# Altium schematic sheet Transmisor.SchDoc
size A3
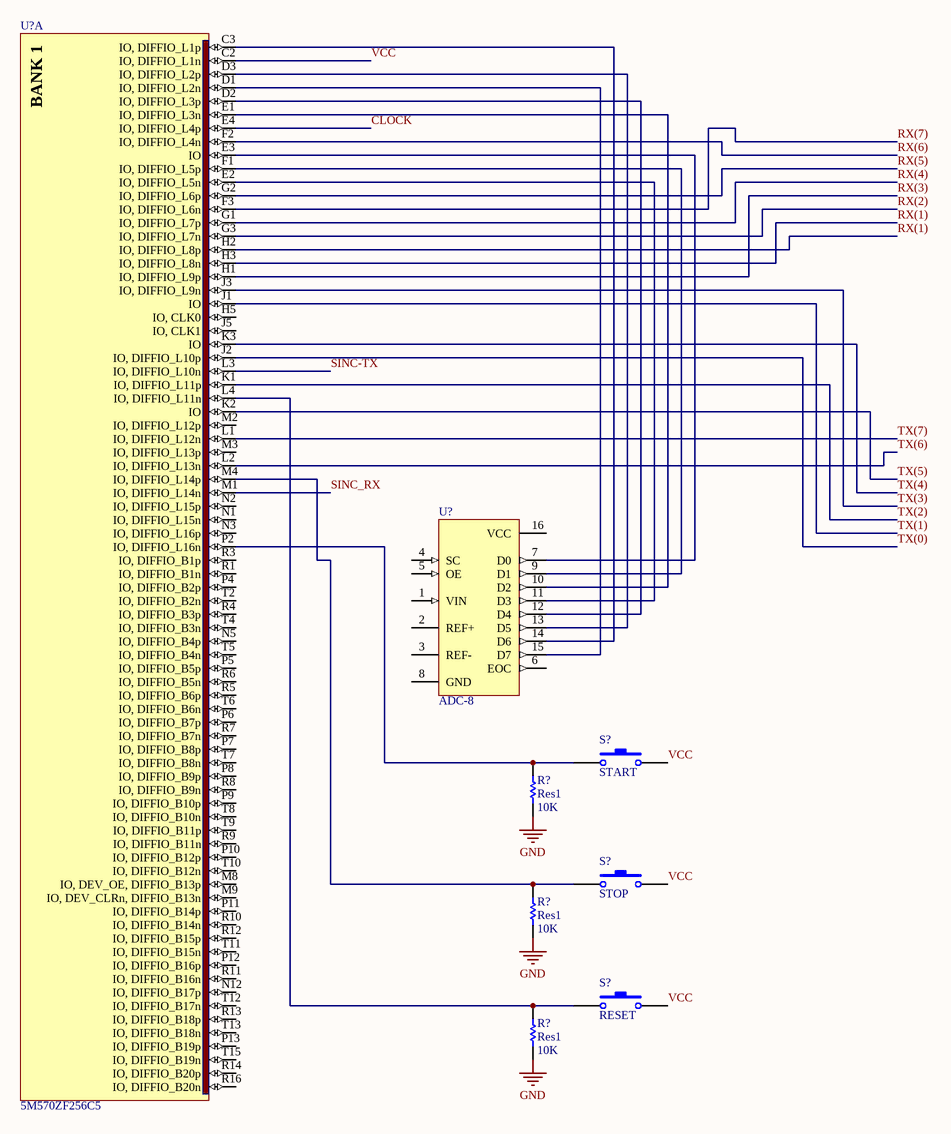
[diagram p0: Transmisor.SchDoc]

## Parts
(Parts that share a designator on the sheet are numbered #1, #2 ... from top to bottom, then left to right.)
R?#1  Res1  value 10K  [AXIAL-0.3]
R?#2  Res1  value 10K  [AXIAL-0.3]
R?#3  Res1  value 10K  [AXIAL-0.3]
S?#1  START  [SPST-2]
S?#2  STOP  [SPST-2]
S?#3  RESET  [SPST-2]
U?#1  5M570ZF256C5  [FBGA256_A-155]  (part A of 5)
U?#2  ADC-8  [SOT403-1_N]

## Nets
GND: R?#1.1 R?#2.1 R?#3.1
CLOCK: U?#1.E4(IO,_DIFFIO_L4p)
RX(1): U?#1.H2(IO,_DIFFIO_L8p) U?#1.H3(IO,_DIFFIO_L8n)
RX(2): U?#1.G3(IO,_DIFFIO_L7n)
RX(3): U?#1.H1(IO,_DIFFIO_L9p)
RX(4): U?#1.G1(IO,_DIFFIO_L7p)
RX(5): U?#1.G2(IO,_DIFFIO_L6p)
RX(6): U?#1.F2(IO,_DIFFIO_L4n)
RX(7): U?#1.F3(IO,_DIFFIO_L6n)
SINC-TX: U?#1.L3(IO,_DIFFIO_L10n)
SINC_RX: U?#1.M1(IO,_DIFFIO_L14n)
TX(0): U?#1.J2(IO,_DIFFIO_L10p)
TX(1): U?#1.J1(IO)
TX(2): U?#1.K1(IO,_DIFFIO_L11p)
TX(3): U?#1.J3(IO,_DIFFIO_L9n)
TX(4): U?#1.K3(IO)
TX(5): U?#1.K2(IO)
TX(6): U?#1.L2(IO,_DIFFIO_L13n)
TX(7): U?#1.L1(IO,_DIFFIO_L12n)
VCC: S?#1.2 S?#2.2 S?#3.2 U?#1.C2(IO,_DIFFIO_L1n)
NetR?#1_2: R?#1.2 S?#1.1 U?#1.P2(IO,_DIFFIO_L16n)
NetR?#2_2: R?#2.2 S?#2.1 U?#1.M4(IO,_DIFFIO_L14p)
NetR?#3_2: R?#3.2 S?#3.1 U?#1.L4(IO,_DIFFIO_L11n)
NetU?#1_C3: U?#1.C3(IO,_DIFFIO_L1p) U?#2.14(D6)
NetU?#1_D1: U?#1.D1(IO,_DIFFIO_L2n) U?#2.15(D7)
NetU?#1_D2: U?#1.D2(IO,_DIFFIO_L3p) U?#2.12(D4)
NetU?#1_D3: U?#1.D3(IO,_DIFFIO_L2p) U?#2.13(D5)
NetU?#1_E1: U?#1.E1(IO,_DIFFIO_L3n) U?#2.10(D2)
NetU?#1_E2: U?#1.E2(IO,_DIFFIO_L5n) U?#2.11(D3)
NetU?#1_E3: U?#1.E3(IO) U?#2.7(D0)
NetU?#1_F1: U?#1.F1(IO,_DIFFIO_L5p) U?#2.9(D1)

Not connected (* = marked no-connect by the designer): U?#1 H5(IO,_CLK0) J5(IO,_CLK1) M2(IO,_DIFFIO_L12p) M3(IO,_DIFFIO_L13p) M8(IO,_DEV_OE,_DIFFIO_B13p) M9(IO,_DEV_CLRn,_DIFFIO_B13n) N1(IO,_DIFFIO_L15n) N2(IO,_DIFFIO_L15p) N3(IO,_DIFFIO_L16p) N5(IO,_DIFFIO_B4p) N12(IO,_DIFFIO_B17p) P4(IO,_DIFFIO_B2p) P5(IO,_DIFFIO_B5p) P6(IO,_DIFFIO_B7p) P7(IO,_DIFFIO_B8p) P8(IO,_DIFFIO_B9p) P9(IO,_DIFFIO_B10p) P10(IO,_DIFFIO_B12p) P11(IO,_DIFFIO_B14p) P12(IO,_DIFFIO_B16p) P13(IO,_DIFFIO_B19p) R1(IO,_DIFFIO_B1n) R3(IO,_DIFFIO_B1p) R4(IO,_DIFFIO_B3p) R5(IO,_DIFFIO_B6p) R6(IO,_DIFFIO_B5n) R7(IO,_DIFFIO_B7n) R8(IO,_DIFFIO_B9n) R9(IO,_DIFFIO_B11n) R10(IO,_DIFFIO_B14n) R11(IO,_DIFFIO_B16n) R12(IO,_DIFFIO_B15p) R13(IO,_DIFFIO_B18p) R14(IO,_DIFFIO_B20p) R16(IO,_DIFFIO_B20n) T2(IO,_DIFFIO_B2n) T4(IO,_DIFFIO_B3n) T5(IO,_DIFFIO_B4n) T6(IO,_DIFFIO_B6n) T7(IO,_DIFFIO_B8n) T8(IO,_DIFFIO_B10n) T9(IO,_DIFFIO_B11p) T10(IO,_DIFFIO_B12n) T11(IO,_DIFFIO_B15n) T12(IO,_DIFFIO_B17n) T13(IO,_DIFFIO_B18n) T15(IO,_DIFFIO_B19n); U?#2 1(VIN) 2(REF+) 3(REF-) 4(SC) 5(OE) 6(EOC) 8(GND) 16(VCC)

## Notes on the sheet
- (in symbol 5M570ZF256C5, part A) BANK 1

## Library data of the parts
R?#1-R?#3 = Res1: Resistor; Published: 8-Jun-2000; LatestRevisionDate: 17-Jul-2002; LatestRevisionNote: Re-released for DXP Platform.; PackageReference: AXIAL-0.3; Publisher: Altium Limited; PackageDescription: Axial Device, Thru-Hole; 2 Leads; 0.3 in Pin Spacing
S?#1-S?#3 = SW-PB: Switch; Published: 24-Mar-1999; LatestRevisionDate: 17-Jul-2002; LatestRevisionNote: Re-released for DXP Platform.; PackageReference: SPST-2; Publisher: Altium Limited; PackageDescription: Switch; 2 Leads
U?#1 = 5M570ZF256C5: MAX V 1.8V CPLD, 159 IOs, 570 Logic Elements, 256-Pin FBGA, Commercial Temperature, Speed Grade 5; DatasheetVersion: ver1.2, May-2011; PackageVersion: ver2.0, Nov-2011; PackageReference: FBGA256_A-155; PackageDescription: 256-Pin FineLine Ball-Grid Array (FBGA) - Thin - Wire Bond - A:1.55; Code_JEDEC: MO-192-DAF-1; ComponentLink1Description: Manufacturer URL; ComponentLink1URL: http://www.altera.com/; ComponentLink2Description: Datasheet; ComponentLink2URL: http://www.altera.com/literature/hb/max-v/max5_handbook.pdf; ComponentLink3Description: MAX V Device Pin-Out files; ComponentLink3URL: http://www.altera.com/literature/lit-dp.jsp?category=MAX%205&showspreadsheet=y; ComponentLink4Description: Package Specification; ComponentLink4URL: http://www.altera.com/devicepackaging/04R-00230_03.pdf
U?#2 = ADC-8: Generic 8-Bit A/D Converter; Published: 8-Jun-2000; LatestRevisionDate: 29-May-2009; LatestRevisionNote: IPC-7351 Footprint Added.; PackageVersion: Mar-2002; PackageReference: SOT403-1; Publisher: Altium Limited; PackageDescription: 16-Pin Thin Small Outline Package 0.65 mm Pitch; Code_JEDEC: MO-153